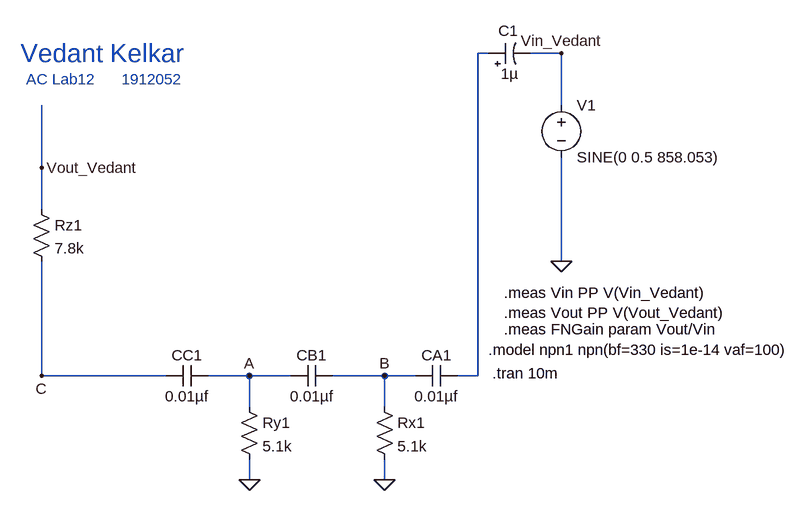
[diagram p0: schematic AC_Lab123.asc]
AC_Lab123.asc, the LTspice schematic file:
Version 4
SHEET 1 1112 708
WIRE 592 0 576 0
WIRE 704 0 656 0
WIRE 704 80 704 0
WIRE -96 176 -96 80
WIRE -96 240 -96 176
WIRE 704 320 704 160
WIRE -96 496 -96 320
WIRE 96 496 -96 496
WIRE 224 496 160 496
WIRE 288 496 224 496
WIRE 432 496 352 496
WIRE 480 496 432 496
WIRE 576 496 576 0
WIRE 576 496 544 496
WIRE 224 544 224 496
WIRE 432 544 432 496
WIRE 224 656 224 624
WIRE 432 656 432 624
FLAG 224 656 0
FLAG 432 656 0
FLAG 224 496 A
FLAG 432 496 B
FLAG -96 496 C
FLAG -96 176 Vout_Vedant
FLAG 704 320 0
FLAG 704 0 Vin_Vedant
SYMBOL res -112 224 R0
SYMATTR InstName Rz1
SYMATTR Value 7.8k
SYMBOL cap 160 480 R90
WINDOW 0 0 32 VBottom 2
WINDOW 3 32 32 VTop 2
SYMATTR InstName CC1
SYMATTR Value 0.01µf
SYMBOL cap 352 480 R90
WINDOW 0 0 32 VBottom 2
WINDOW 3 32 32 VTop 2
SYMATTR InstName CB1
SYMATTR Value 0.01µf
SYMBOL cap 544 480 R90
WINDOW 0 0 32 VBottom 2
WINDOW 3 32 32 VTop 2
SYMATTR InstName CA1
SYMATTR Value 0.01µf
SYMBOL res 208 528 R0
SYMATTR InstName Ry1
SYMATTR Value 5.1k
SYMBOL res 416 528 R0
SYMATTR InstName Rx1
SYMATTR Value 5.1k
SYMBOL polcap 592 16 R270
WINDOW 0 35 31 VTop 2
WINDOW 3 0 33 VBottom 2
SYMATTR InstName C1
SYMATTR Value 1µ
SYMATTR Description Capacitor
SYMATTR Type cap
SYMATTR SpiceLine V=16 Irms=0 Rser=11 Lser=0 mfg="AVX" pn="TAJA105K016" type="Tantalum"
SYMBOL voltage 704 64 R0
WINDOW 123 0 0 Left 0
WINDOW 39 0 0 Left 0
SYMATTR InstName V1
SYMATTR Value SINE(0 0.5 858.053)
TEXT -128 0 Left 4 ;Vedant Kelkar
TEXT -120 40 Left 2 ;AC Lab12      1912052
TEXT 592 456 Left 2 !.model npn1 npn(bf=330 is=1e-14 vaf=100)
TEXT 598 492 Left 2 !.tran 10m
TEXT 616 368 Left 2 !.meas Vin PP V(Vin_Vedant)\n.meas Vout PP V(Vout_Vedant)
TEXT 616 424 Left 2 !.meas FNGain param Vout/Vin

The netlist it stands for:
* AC_Lab123.asc
Rz1 Vout_Vedant C 7.8k
CC1 A C 0.01µf
CB1 B A 0.01µf
CA1 N001 B 0.01µf
Ry1 A 0 5.1k
Rx1 B 0 5.1k
C1 N001 Vin_Vedant 1µ V=16 Irms=0 Rser=11 Lser=0 mfg="AVX" pn="TAJA105K016" type="Tantalum"
V1 Vin_Vedant 0 SINE(0 0.5 858.053)
* Vedant Kelkar
* AC Lab12      1912052
.model npn1 npn(bf=330 is=1e-14 vaf=100)
.tran 10m
.meas Vin PP V(Vin_Vedant)
.meas Vout PP V(Vout_Vedant)
.meas FNGain param Vout/Vin
.backanno
.end